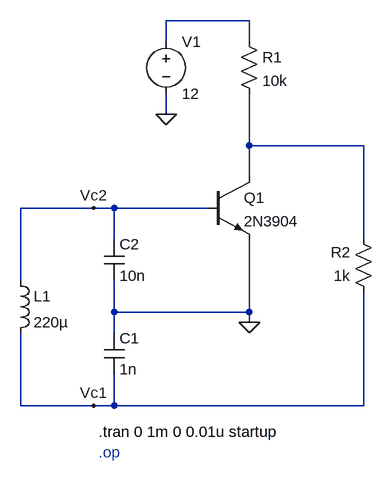
[diagram p0: schematic basic_colpitts_falstad_orig.asc]
basic_colpitts_falstad_orig.asc, the LTspice schematic file:
Version 4
SHEET 1 880 680
WIRE 592 -256 464 -256
WIRE 464 -224 464 -256
WIRE 592 -224 592 -256
WIRE 464 -112 464 -144
WIRE 592 -64 592 -144
WIRE 768 -64 592 -64
WIRE 592 -16 592 -64
WIRE 352 32 240 32
WIRE 384 32 352 32
WIRE 528 32 384 32
WIRE 384 80 384 32
WIRE 768 80 768 -64
WIRE 240 144 240 32
WIRE 384 192 384 144
WIRE 592 192 592 80
WIRE 592 192 384 192
WIRE 592 208 592 192
WIRE 384 224 384 192
WIRE 240 336 240 224
WIRE 352 336 240 336
WIRE 384 336 384 288
WIRE 384 336 352 336
WIRE 768 336 768 160
WIRE 768 336 384 336
FLAG 592 208 0
FLAG 464 -112 0
FLAG 352 336 Vc1
FLAG 352 32 Vc2
SYMBOL cap 368 224 R0
SYMATTR InstName C1
SYMATTR Value 1n
SYMBOL cap 368 80 R0
SYMATTR InstName C2
SYMATTR Value 10n
SYMBOL ind 224 128 R0
SYMATTR InstName L1
SYMATTR Value 220µ
SYMBOL npn 528 -16 R0
SYMATTR InstName Q1
SYMATTR Value 2N3904
SYMBOL res 576 -240 R0
SYMATTR InstName R1
SYMATTR Value 10k
SYMBOL voltage 464 -240 R0
WINDOW 123 0 0 Left 0
WINDOW 39 0 0 Left 0
SYMATTR InstName V1
SYMATTR Value 12
SYMBOL res 784 176 R180
WINDOW 0 36 76 Left 2
WINDOW 3 36 40 Left 2
SYMATTR InstName R2
SYMATTR Value 1k
TEXT 360 376 Left 2 !.tran 0 1m 0 0.01u startup
TEXT 360 408 Left 2 ;.op

The netlist it stands for:
* basic_colpitts_falstad_orig.asc
C1 0 Vc1 1n
C2 Vc2 0 10n
L1 Vc2 Vc1 220µ
Q1 N002 Vc2 0 0 2N3904
R1 N001 N002 10k
V1 N001 0 12
R2 Vc1 N002 1k
.model NPN NPN
.model PNP PNP
.lib standard.bjt
.tran 0 1m 0 0.01u startup
* .op
.backanno
.end